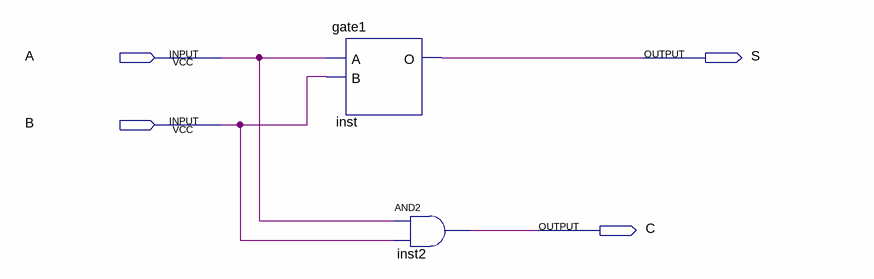
[diagram p0: schematic sheet]
// Quartus schematic helfAdder.bdf as structural Verilog: 2 symbols, 4 pins
module helfAdder (
  input  A,
  input  B,
  output S,
  output C
);

  gate1 inst (.A(A), .B(B), .O(S));
  and inst2 (C, A, B);
endmodule
